# Altium schematic sheet Top.SchDoc
size Letter; Organization: Colorado School of Mines; Address1: 1500 Illinois St.; Address2: Golden; Address3: CO 80401; Address4: USA; SheetNumber: 1; SheetTotal: 2
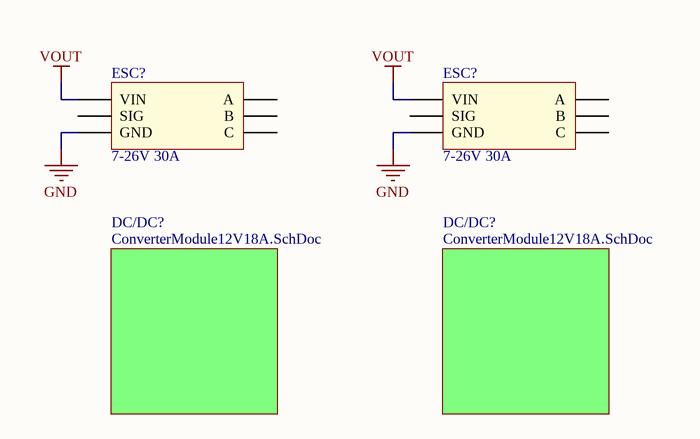
[diagram p0: Top.SchDoc]

## Parts
(Parts that share a designator on the sheet are numbered #1, #2 ... from top to bottom, then left to right.)
ESC?#1  7-26V 30A  [BasicESC]
ESC?#2  7-26V 30A  [BasicESC]

## Sub-sheets
DC/DC? = ConverterModule12V18A.SchDoc: no entries
DC/DC? = ConverterModule12V18A.SchDoc: no entries

## Nets
GND: ESC?#1.GND ESC?#2.GND
VOUT: ESC?#1.VIN ESC?#2.VIN

Not connected (* = marked no-connect by the designer): ESC?#1 A B C SIG; ESC?#2 A B C SIG

## Notes on the sheet
- Title
- Size:
- Date:
- Letter
- Number:
- Time:
- Revision:
- Sheet
- of
- File:

## Library data of the parts
ESC?#1 ESC?#2 = BasicESC: Blue Robotics BasicESC; Manufacturer: Blue Robotics; Part Number: *; Value: 7-26V 30A; ComponentLink1Description: Blue Robotics; ComponentLink1URL: https://bluerobotics.com/store/thrusters/speed-controllers/besc30-r3/